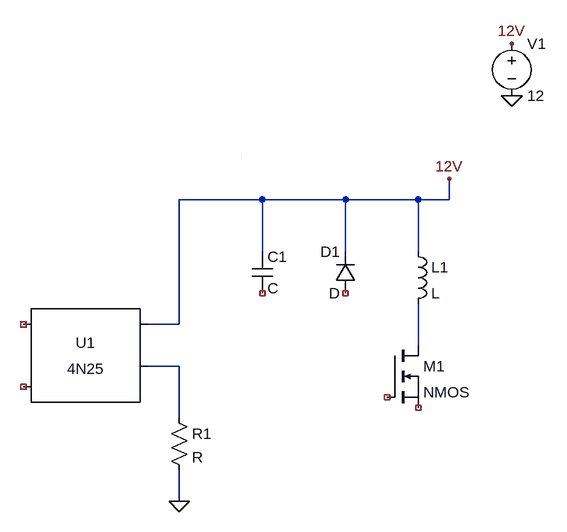
[diagram p0: schematic Draft6.asc]
Draft6.asc, the LTspice schematic file:
Version 4
SHEET 1 880 680
WIRE 32 64 -96 64
WIRE 160 64 32 64
WIRE 272 64 160 64
WIRE 320 64 320 32
WIRE 320 64 272 64
WIRE 32 144 32 64
WIRE 160 144 160 64
WIRE 272 144 272 64
WIRE -96 256 -96 64
WIRE -96 256 -144 256
WIRE 272 288 272 224
WIRE -96 320 -144 320
WIRE -96 400 -96 320
WIRE -96 528 -96 480
WIRE 0 0 0 0
FLAG 416 -96 0
FLAG 416 -176 12V
FLAG 320 32 12V
FLAG -96 528 0
SYMBOL ind 256 128 R0
SYMATTR InstName L1
SYMBOL Optos\\4N25 -240 320 R0
SYMATTR InstName U1
SYMBOL nmos 224 288 R0
SYMATTR InstName M1
SYMBOL voltage 416 -192 R0
WINDOW 123 0 0 Left 0
WINDOW 39 0 0 Left 0
SYMATTR InstName V1
SYMATTR Value 12
SYMBOL diode 176 208 R180
WINDOW 0 24 64 Left 2
WINDOW 3 24 0 Left 2
SYMATTR InstName D1
SYMBOL cap 16 144 R0
SYMATTR InstName C1
SYMBOL res -112 384 R0
SYMATTR InstName R1

The netlist it stands for:
* Draft6.asc
L1 12V N001 L
XU1 NC_01 NC_02 12V N002 NC_03 4N25
M1 N001 NC_04 NC_05 NC_05 NMOS
V1 12V 0 12
D1 NC_06 12V D
C1 12V NC_07 C
R1 N002 0 R
.model D D
.lib standard.dio
.model NMOS NMOS
.model PMOS PMOS
.lib standard.mos
.lib 4N25.sub
.backanno
.end